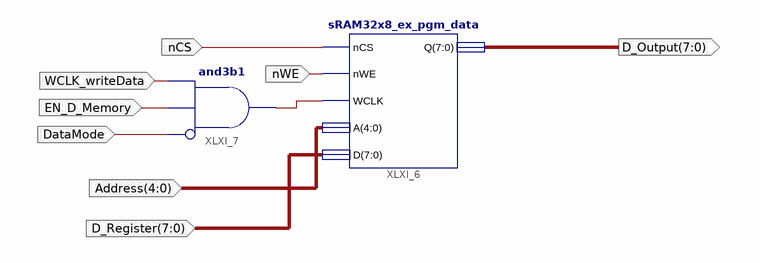
[diagram p0: schematic sheet 1]
// Xilinx ISE schematic D_Memory.sch (spartan3e) as structural Verilog: 2 symbols, 8 ports
module D_Memory (
  input  nCS,
  input  [4:0] Address,
  input  [7:0] D_Register,
  input  nWE,
  input  EN_D_Memory,
  input  DataMode,
  input  WCLK_writeData,
  output [7:0] D_Output
);

  wire XLXN_28;

  sRAM32x8_ex_pgm_data XLXI_6 (.nCS(nCS), .nWE(nWE), .WCLK(XLXN_28), .A(Address), .D(D_Register), .Q(D_Output));
  and XLXI_7 (XLXN_28, ~DataMode, EN_D_Memory, WCLK_writeData);  // and3b1
endmodule
